# Altium schematic sheet heater-pwm-logic.SchDoc
size A
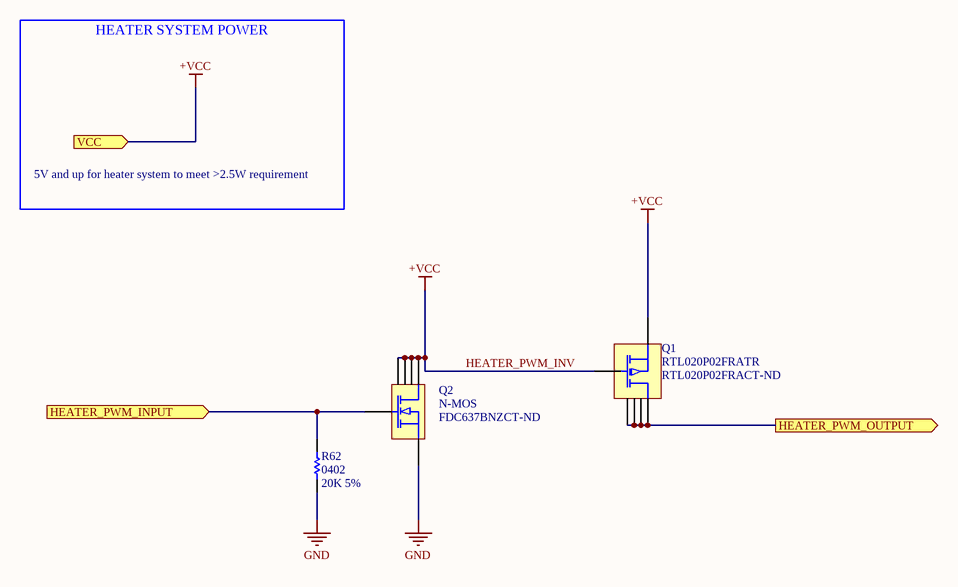
[diagram p0: heater-pwm-logic.SchDoc]

## Parts
Q1  RTL020P02FRATR  Supplier Part Number 1: RTL020P02FRACT-ND  [SOT95P280X145-6N]
Q2  N-MOS  [SOT95P280X145-6N]
R62  0402  value 20K 5%  [RES0402R]

## Ports
HEATER_PWM_INPUT (in), HEATER_PWM_OUTPUT (out), VCC (in)

## Nets
GND: Q2.4(S) R62.1
HEATER_PWM_INV: Q1.3(G) Q1.4(S) Q2.1(D) Q2.2(D) Q2.5(D) Q2.6(D) ; port VCC  [also labelled +VCC]
HEATER_PWM_INPUT: Q2.3(G) R62.2 ; port HEATER_PWM_INPUT
HEATER_PWM_OUTPUT: Q1.1(D) Q1.2(D) Q1.5(D) Q1.6(D) ; port HEATER_PWM_OUTPUT

## Notes on the sheet
- 5V and up for heater system to meet >2.5W requirement
- HEATER SYSTEM POWER

## Library data of the parts
Q1 = RTL020P02FRATR: 2.5V DRIVE PCH MOSFET, AEC-Q101, 20V 2A (Ta) 1W (Ta) Surface Mount TUMT6; ComponentLink1Description: Datasheet; ComponentLink1URL: http://rohmfs.rohm.com/en/products/databook/datasheet/discrete/transistor/mosfet/rtl020p02fra.pdf; Supplier 1: Digi-Key
Q2 = FDC637BNZCT-ND: 20V 6.2A, N-MOS, low gate on voltage; Supplier 1: Digi-Key; Supplier Part Number 1: FDC637BNZCT-ND
R62 = RES0402: 0402 resistor